# EAGLE design IDS_ADC_SMT_v2 (EAGLE 9.5.0)
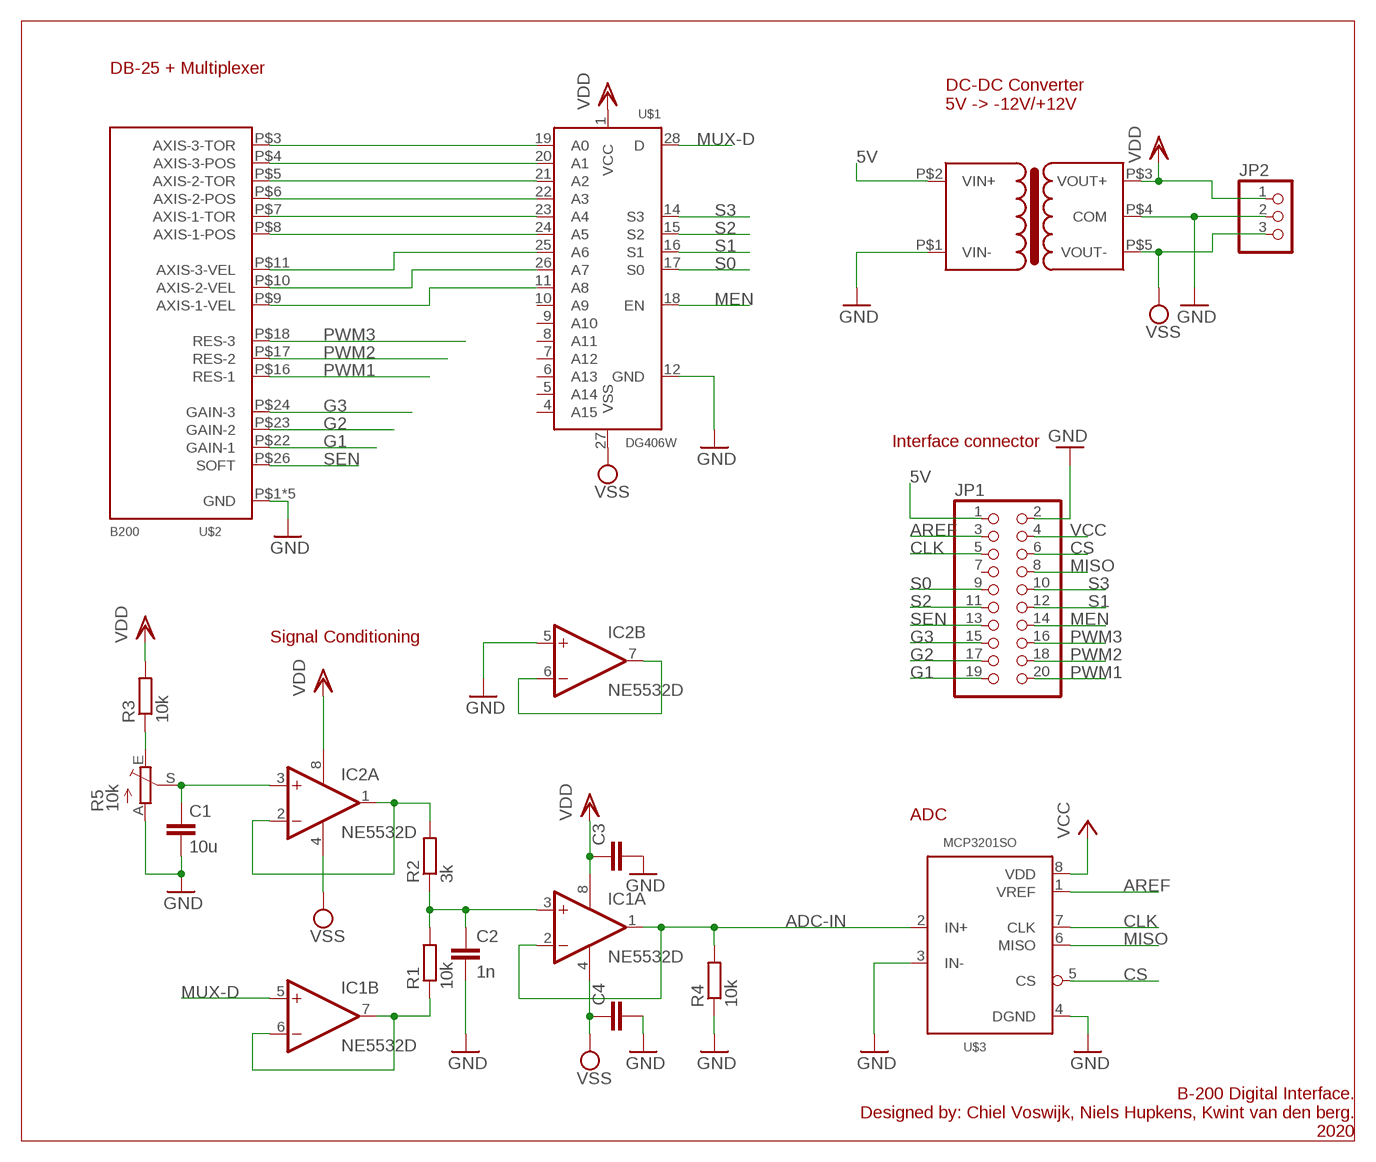
[diagram p0: schematic, sheet 1]

## Parts
C1  10u  C-EUC1210  [C1210]
C2  1n  C-EUC0805  [C0805]
C3  C-EUC0805  [C0805]
C4  C-EUC0805  [C0805]
IC1  NE5532D  [SO08]
IC2  NE5532D  [SO08]
JP1  PINHD-2X10  [2X10]
JP2  PINHD-1X3  [1X03]
R1  10k  R-EU_R0805  [R0805]
R2  3k  R-EU_R0805  [R0805]
R3  10k  R-EU_R0805  [R0805]
R4  10k  R-EU_R0805  [R0805]
R5  10k  TRIM_EU-RJ9W  [RJ9W]
U$1  DG406W  [SO-28W]
U$2  B200  [PARALLEL]
U$3  MCP3201SO  [SO-8]
U$4  TRACO-DR-NE  [TRACO-DCDC-SIP6]

## Nets
5V: JP1.1 U$4.P$2(VIN+)
ADC-IN: IC1.1(A:OUT) IC1.2(A:-IN) R4.2 U$3.2(IN+)
AREF: JP1.3 U$3.1(VREF)
CLK: JP1.5 U$3.7(CLK)
CS: JP1.6 U$3.5(CS)
G1: JP1.19 U$2.P$22(GAIN-1)
G2: JP1.17 U$2.P$23(GAIN-2)
G3: JP1.15 U$2.P$24(GAIN-3)
GND: C1.2 C2.2 C3.2 C4.2 IC2.5(B:+IN) JP1.2 JP2.2 R4.1 R5.A U$1.12(GND) U$2.P$1(GND) U$2.P$2(GND) U$2.P$19(GND) U$2.P$20(GND) U$2.P$21(GND) U$3.3(IN-) U$3.4(DGND) U$4.P$1(VIN-) U$4.P$4(COM)
MEN: JP1.14 U$1.18(EN)
MISO: JP1.8 U$3.6(MISO)
MUX-D: IC1.5(B:+IN) U$1.28(D)
N$1: IC2.6(B:-IN) IC2.7(B:OUT)
N$2: U$1.19(A0) U$2.P$3(AXIS-3-TOR)
N$3: C2.1 IC1.3(A:+IN) R1.2 R2.1
N$4: U$1.20(A1) U$2.P$4(AXIS-3-POS)
N$5: IC1.6(B:-IN) IC1.7(B:OUT) R1.1
N$6: U$1.21(A2) U$2.P$5(AXIS-2-TOR)
N$7: IC2.1(A:OUT) IC2.2(A:-IN) R2.2
N$8: C1.1 IC2.3(A:+IN) R5.S
N$9: U$1.22(A3) U$2.P$6(AXIS-2-POS)
N$10: U$1.23(A4) U$2.P$7(AXIS-1-TOR)
N$11: U$1.24(A5) U$2.P$8(AXIS-1-POS)
N$12: U$1.25(A6) U$2.P$11(AXIS-3-VEL)
N$13: U$1.26(A7) U$2.P$10(AXIS-2-VEL)
N$14: U$1.11(A8) U$2.P$9(AXIS-1-VEL)
N$15: R3.1 R5.E
PWM1: JP1.20 U$2.P$16(RES-1)
PWM2: JP1.18 U$2.P$17(RES-2)
PWM3: JP1.16 U$2.P$18(RES-3)
S0: JP1.9 U$1.17(S0)
S1: JP1.12 U$1.16(S1)
S2: JP1.11 U$1.15(S2)
S3: JP1.10 U$1.14(S3)
SEN: JP1.13 U$2.P$26(SOFT)
VCC: JP1.4 U$3.8(VDD)
VDD: C3.1 IC1.8(P:V+) IC2.8(P:V+) JP2.1 R3.2 U$1.1(VCC) U$4.P$3(VOUT+)
VSS: C4.1 IC1.4(P:V-) IC2.4(P:V-) JP2.3 U$1.27(VSS) U$4.P$5(VOUT-)
Unconnected: JP1.7 U$1.4(A15) U$1.5(A14) U$1.6(A13) U$1.7(A12) U$1.8(A11) U$1.9(A10) U$1.10(A9)

## Notes on the sheet
- DB-25 + Multiplexer
- DC-DC Converter
  5V -> -12V/+12V
- Interface connector
- Signal Conditioning
- ADC
- B-200 Digital Interface.
  Designed by: Chiel Voswijk, Niels Hupkens, Kwint van den berg.
  2020

## Library data of the parts
C1-C4 = rcl:C-EU: CAPACITOR, European symbol; SPICEPREFIX: C
IC1 IC2 = linear:NE5532: AUDIO AMPLIFIER
JP1 = pinhead:PINHD-2X10: PIN HEADER
JP2 = pinhead:PINHD-1X3: PIN HEADER
R1-R4 = rcl:R-EU_: RESISTOR, European symbol; SPICEPREFIX: R
R5 = pot:TRIM_EU-: POTENTIOMETER
U$1 = FHD-Actives:DG406: "Jellybean" DG406 Multiplexer
U$2 = FHD-Connectors:B200
U$3 = FHD-Actives:MCP3201
U$4 = FHD-POWER:TRACO-DR-NE

## Board
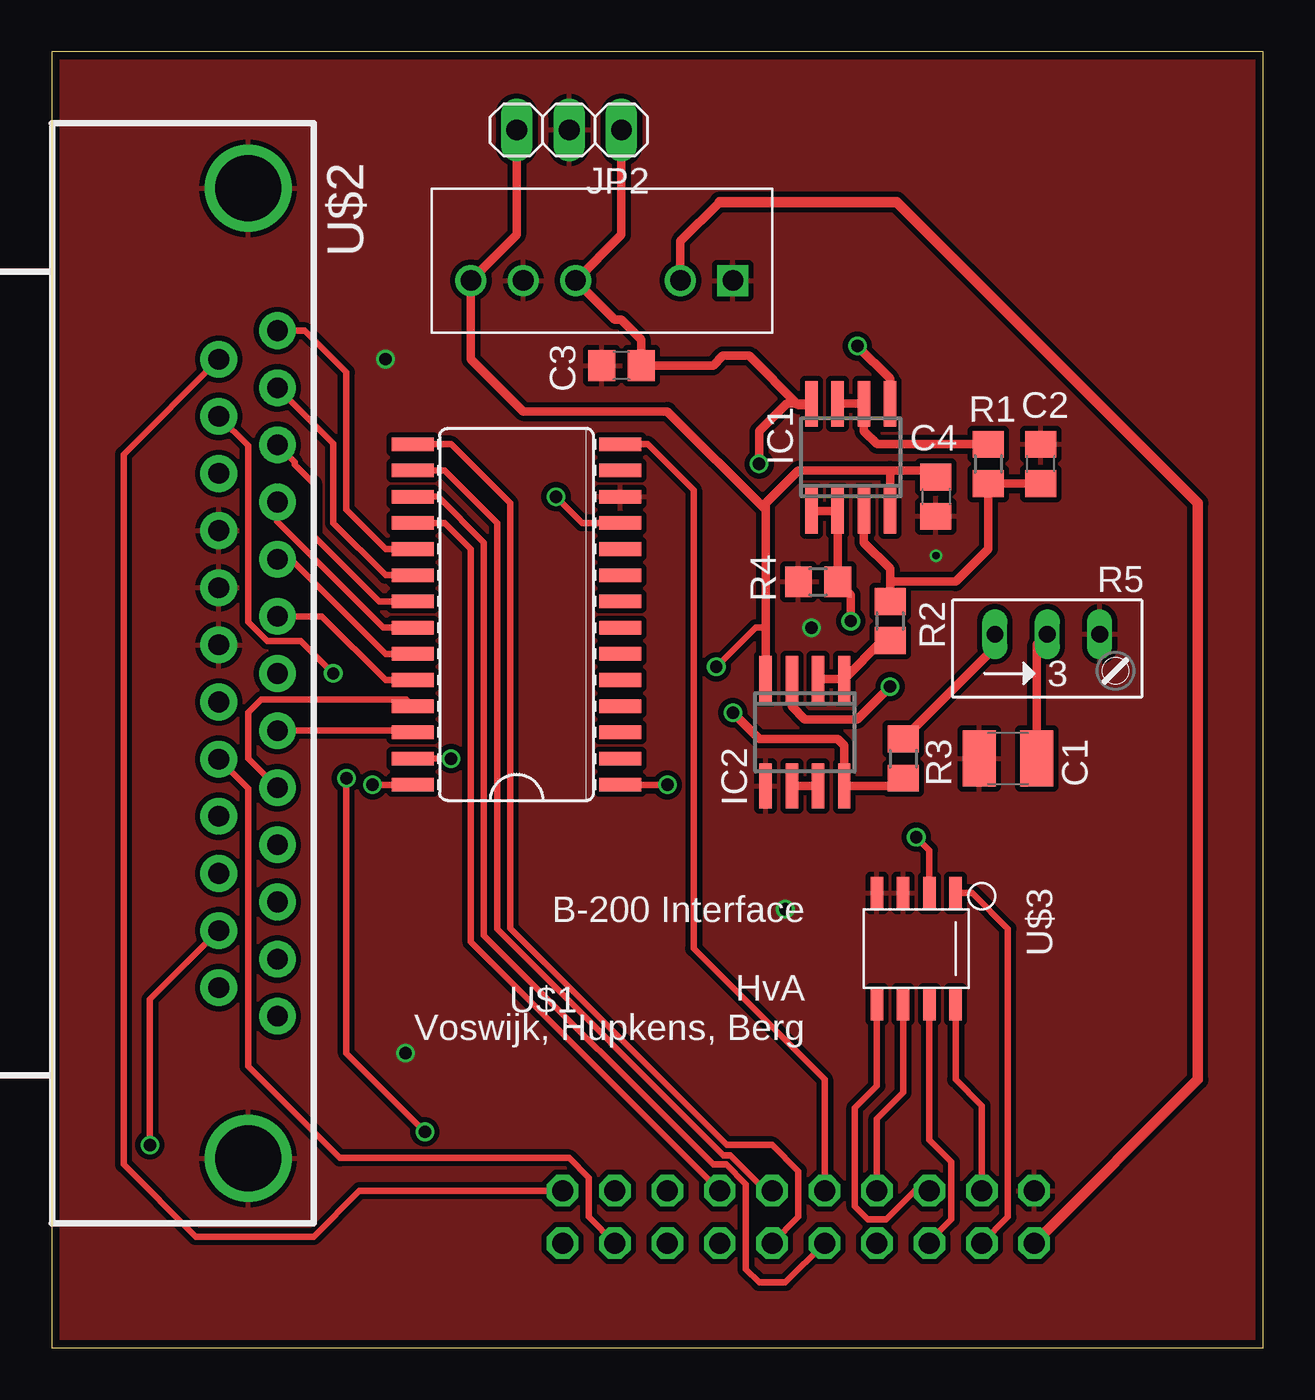
[diagram p1: board, top side]
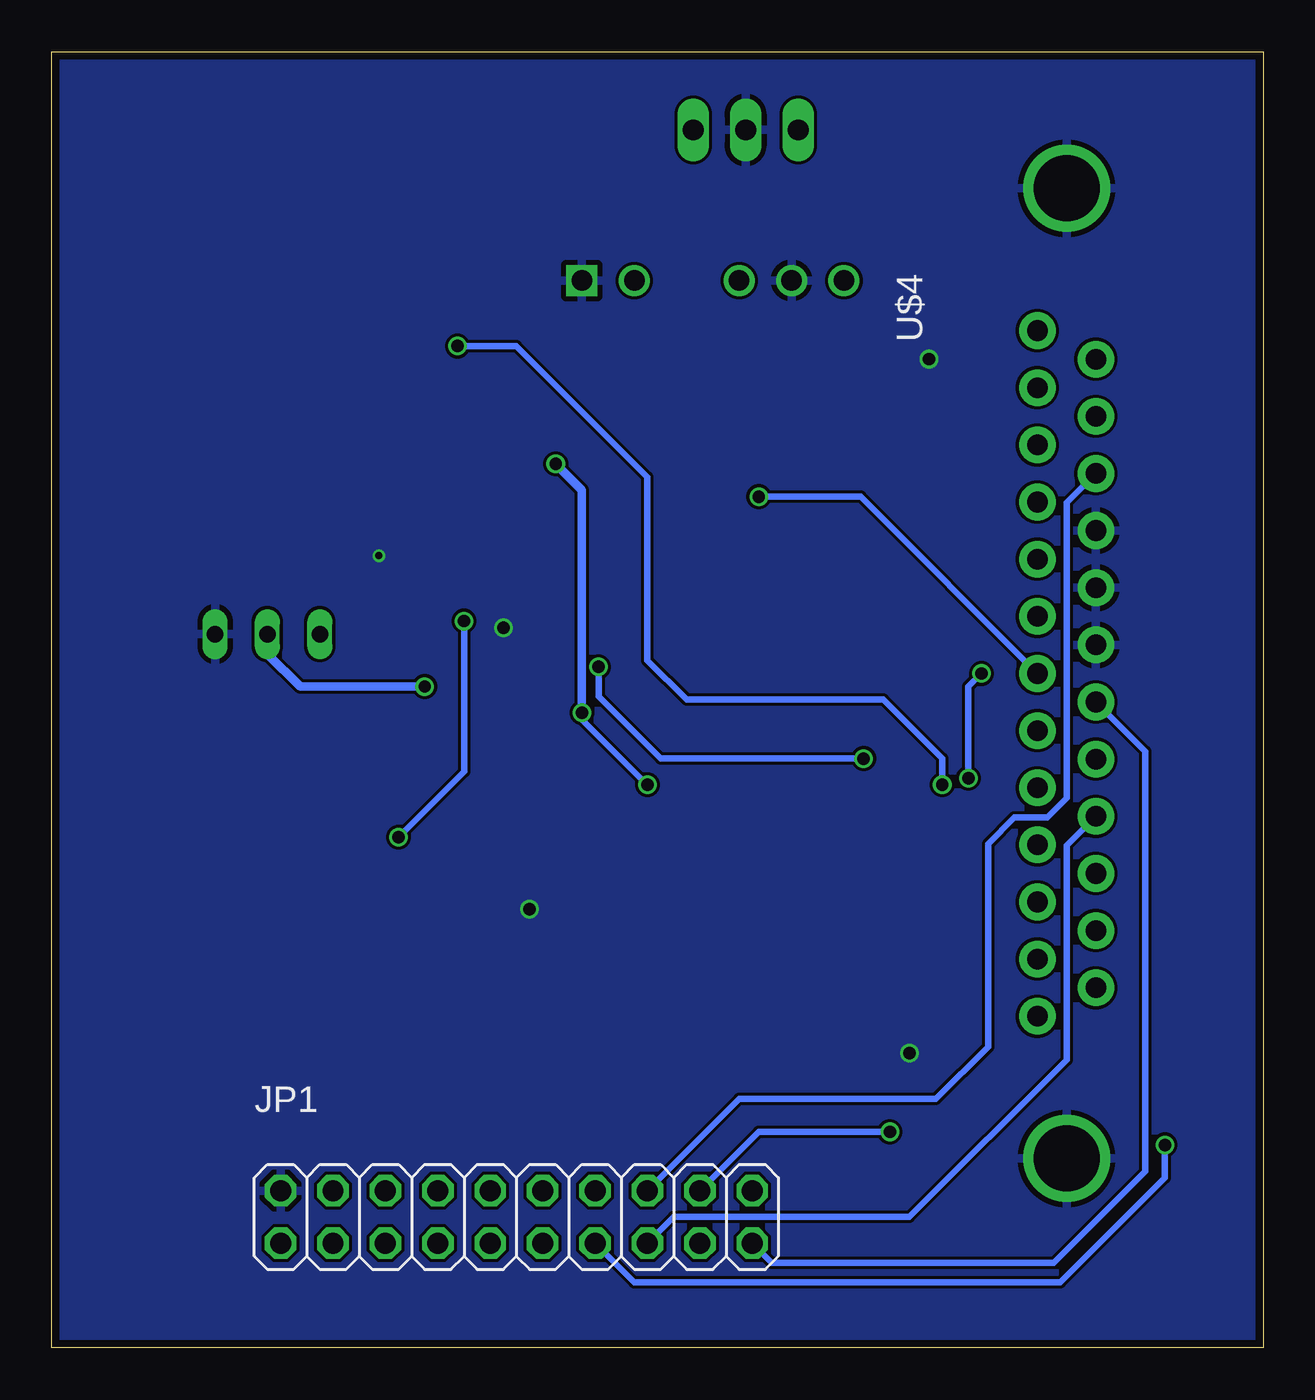
[diagram p2: board, bottom side, seen from below]

Size 58.72 x 62.85 mm. Coordinates in mm from the lower left corner, seen from the top.
Outline: 0,0 58.72,0 58.72,62.85 0,62.85 0,0
Copper layers (1*16): Top 0.035559375mm / dielectric 1.6mm / Bottom 0.035559375mm
Design rules "oshpark-2layer": minimum track width 6mil, minimum drill 10mil, track to track 6mil, track to pad 6mil, pad to pad 6mil, via to via 6mil, smd to smd 6mil, copper to edge 15mil, drill to drill 6mil, minimum pad ring 5mil, minimum via ring 5mil, stop-mask expansion 2.5mil, vias tented up to drill 0mil, thermal gap 10mil

### Footprints (pad centres in the part's own frame; a part is rotated, then mirrored left to right if it is on the bottom)
C1210 = smd 1.6 x 2.7: 1 -1.4,0; 2 1.4,0
C0805 = smd 1.3 x 1.5: 1 -0.95,0; 2 0.95,0
SO08 = smd 0.6 x 2.2: 1 -1.905,-2.6; 2 -0.635,-2.6; 3 0.635,-2.6; 4 1.905,-2.6; 5 1.905,2.6; 6 0.635,2.6; 7 -0.635,2.6; 8 -1.905,2.6
2X10 = drill 1.016 octagon: 1 -11.43,-1.27; 2 -11.43,1.27; 3 -8.89,-1.27; 4 -8.89,1.27; 5 -6.35,-1.27; 6 -6.35,1.27; 7 -3.81,-1.27; 8 -3.81,1.27; 9 -1.27,-1.27; 10 -1.27,1.27; 11 1.27,-1.27; 12 1.27,1.27; 13 3.81,-1.27; 14 3.81,1.27; 15 6.35,-1.27; 16 6.35,1.27; 17 8.89,-1.27; 18 8.89,1.27; 19 11.43,-1.27; 20 11.43,1.27
1X03 = drill 1.016 long: 1 -2.54,0; 2 0,0; 3 2.54,0
R0805 = smd 1.3 x 1.5: 1 -0.95,0; 2 0.95,0
RJ9W = drill 0.813 long: A 2.54,0.635; E -2.54,0.635; S 0,0.635
SO-28W = smd 0.66 x 2.032: 1 -8.255,-5.029; 2 -6.985,-5.029; 3 -5.715,-5.029; 4 -4.445,-5.029; 5 -3.175,-5.029; 6 -1.905,-5.029; 7 -0.635,-5.029; 8 0.635,-5.029; 9 1.905,-5.029; 10 3.175,-5.029; 11 4.445,-5.029; 12 5.715,-5.029; 13 6.985,-5.029; 14 8.255,-5.029; 15 8.255,5.029; 16 6.985,5.029; 17 5.715,5.029; 18 4.445,5.029; 19 3.175,5.029; 20 1.905,5.029; 21 0.635,5.029; 22 -0.635,5.029; 23 -1.905,5.029; 24 -3.175,5.029; 25 -4.445,5.029; 26 -5.715,5.029; 27 -6.985,5.029; 28 -8.255,5.029
PARALLEL = drill 3.2: P$1 -23.52,0; P$2 23.52,0 | drill 1 pad 1.778: P$3 -16.62,1.42; P$4 -13.85,1.42; P$5 -11.08,1.42; P$6 -8.31,1.42; P$7 -5.54,1.42; P$8 -2.77,1.42; P$9 0,1.42; P$10 2.77,1.42; P$11 5.54,1.42; P$12 8.31,1.42; P$13 11.08,1.42; P$14 13.85,1.42; P$15 16.62,1.42; P$16 -15.235,-1.42; P$17 -12.465,-1.42; P$18 -9.695,-1.42; P$19 -6.925,-1.42; P$20 -4.155,-1.42; P$21 -1.385,-1.42; P$22 1.385,-1.42; P$23 4.155,-1.42; P$24 6.925,-1.42; P$25 9.695,-1.42; P$26 12.465,-1.42; P$27 15.235,-1.42
SO-8 = smd 0.6 x 1.55: 1 -1.905,-2.69; 2 -0.635,-2.69; 3 0.635,-2.69; 4 1.905,-2.69; 5 1.905,2.71; 6 0.635,2.71; 7 -0.635,2.71; 8 -1.905,2.71
TRACO-DCDC-SIP6 = drill 1 square: P$1 -8.89,1.27 | drill 1: P$2 -6.35,1.27; P$3 -1.27,1.27; P$4 1.27,1.27; P$5 3.81,1.27

### Placement (x,y rotation side)
C1  46.35,28.57 180 top
C2  47.94,42.86 90 top
C3  27.62,47.62 180 top
C4  42.86,41.27 270 top
IC1  38.73,43.18 0 top
IC2  36.51,29.84 180 top
JP1  36.2,6.35 0 bottom
JP2  25.08,59.05 180 top
R1  45.4,42.86 270 top
R2  40.64,35.24 270 top
R3  41.27,28.57 270 top
R4  37.15,37.15 0 top
R5  48.26,33.97 0 top
U$1  22.54,35.56 90 top
U$2  9.53,32.7 270 top
U$3  41.91,19.37 180 top
U$4  24.13,53.02 180 top

### Tracks (layer width: path | path; a pad name or v marks a point on that pad's centre or on a via)
5V
  Top 0.406: 32.38,55.56 30.48,53.66 U$4.P$2
  Top 0.508: JP1.1 55.56,13.02 55.56,40.96 40.96,55.56 32.38,55.56
ADC-IN  (via drill 0.6)
  Top 0.305: U$3.2 42.54,24.13 v41.91,24.76
  Top 0.406: IC1.1 IC1.2 R4.2 38.73,36.51 v38.73,35.24
  Bottom 0.305: v41.91,24.76 38.73,27.94 v38.73,35.24
AREF
  Top 0.305: JP1.3 46.35,6.35 46.35,20.32 44.62,22.06 U$3.1
CLK
  Top 0.305: U$3.7 42.54,10.08 43.61,9.01 43.61,6.23 42.54,5.16 JP1.5
CS
  Top 0.305: U$3.5 40,12.71 38.94,11.64 38.94,6.86 39.56,6.24 40.45,6.24 41.83,7.62 JP1.6
G1
  Bottom 0.305: U$2.P$22 5.71,28.93 5.71,8.57 10.16,4.13 23.81,4.13 JP1.19
G2
  Top 0.305: JP1.17 26.04,6.35 26.04,8.26 25.08,9.21 13.97,9.21 9.53,13.65 9.53,27.13 U$2.P$23
G3
  Bottom 0.305: U$2.P$24 9.53,24.36 9.53,13.97 17.14,6.35 28.57,6.35 JP1.15
GND  (via drill 0.35, 0.6)
  other vias: 17.14,14.29 16.19,47.94 36.83,34.92 42.86,38.42 35.56,21.27
  pour Top (isolate 0.254): -3.49,0 58.74,0 58.74,65.72 -3.49,65.72
  pour Bottom: -1.27,-1.27 66.04,-1.27 66.04,64.77 -1.27,64.77
MEN
  Top 0.305: JP1.14 20.32,19.69 20.32,38.74 19.05,40 U$1.18
MISO
  Top 0.305: JP1.8 40,11.11 41.27,12.38 U$3.6
MUX-D  (via drill 0.6)
  Top 0.305: U$1.28 v15.56,27.31
  Top 0.406: v39.05,48.58 40.64,46.99 IC1.5
  Bottom 0.305: v15.56,27.31 15.56,28.58 18.42,31.43 27.94,31.43 29.85,33.34 29.85,42.23 36.2,48.58 v39.05,48.58
N$1
  Top 0.406: IC2.7 IC2.6
N$2
  Top 0.305: U$1.19 16.19,38.74 14.29,40.64 14.29,47.31 12.27,49.32 U$2.P$3
N$3
  Top 0.406: C2.1 R1.2 45.4,38.74 43.81,37.15 40.64,37.15 | IC1.3 39.37,39.05 40.64,37.78 40.64,37.15 | 40.64,37.15 R2.1
N$4
  Top 0.305: U$2.P$4 13.65,43.85 13.65,40 16.19,37.46 U$1.20
N$5
  Top 0.406: IC1.7 IC1.6 39.37,44.45 40.01,43.81 R1.1
N$6
  Top 0.305: U$2.P$5 11.78,42.95 11.78,42.83 12.7,41.91 12.7,39.37 15.87,36.2 U$1.21
N$7
  Top 0.406: IC2.2 IC2.1 40.27,34.29 R2.2
N$8  (via drill 0.6)
  Top 0.406: IC2.3 35.88,31.11 36.51,30.48 39.05,30.48 v40.64,32.07 | C1.1 47.75,34.1 R5.S
  Bottom 0.406: v40.64,32.07 46.67,32.07 48.26,33.66 R5.S
N$9
  Top 0.305: U$2.P$6 10.95,40.06 16.08,34.92 U$1.22
N$10
  Top 0.305: U$2.P$7 11.09,38.1 11.75,38.1 16.19,33.66 U$1.23
N$11
  Top 0.305: U$2.P$8 13.1,35.47 16.19,32.38 U$1.24
N$12
  Top 0.305: U$2.P$11 9.53,28.58 9.53,30.8 10.16,31.43 17.2,31.43 U$1.25
N$13
  Top 0.305: U$1.26 17.43,29.93 U$2.P$10
N$14  (via drill 0.6)
  Top 0.305: U$1.11 25.72,40 v24.45,41.28
  Bottom 0.305: U$2.P$9 19.52,41.28 v24.45,41.28
N$15
  Top 0.406: R3.1 45.72,33.97 R5.E
PWM1
  Top 0.305: U$2.P$16 3.49,43.32 3.49,8.89 6.98,5.4 12.7,5.4 14.92,7.62 JP1.20
PWM2  (via drill 0.6)
  Top 0.305: v18.1,10.48 14.29,14.29 v14.29,27.62 | v13.65,32.7 12.08,34.28 10.45,34.28 9.53,35.2 9.53,43.75 U$2.P$17
  Bottom 0.305: JP1.18 24.45,10.48 v18.1,10.48 | v14.29,27.62 14.29,32.07 v13.65,32.7
PWM3
  Bottom 0.305: U$2.P$18 9.53,40.98 9.53,26.67 10.48,25.72 12.06,25.72 13.33,24.45 13.33,14.61 15.87,12.06 25.4,12.06 JP1.16
S0
  Top 0.305: U$1.17 18.73,41.28 20.96,39.05 20.96,20 32.07,8.89 32.7,8.89 33.66,7.94 33.66,3.81 34.29,3.17 35.56,3.17 JP1.9
S1
  Top 0.305: U$1.16 19.05,42.55 21.59,40 21.59,20.32 32.56,9.35 32.89,9.35 34.62,7.62 JP1.12
S2
  Top 0.305: JP1.11 36.2,6.35 36.2,8.57 34.92,9.84 32.71,9.84 22.23,20.33 22.23,40.96 19.37,43.81 U$1.15
S3
  Top 0.305: U$1.14 28.89,43.81 31.11,41.59 31.11,19.37 37.46,13.02 JP1.10
SEN  (via drill 0.6)
  Top 0.305: U$2.P$26 4.76,16.89 v4.76,9.84
  Bottom 0.305: v4.76,9.84 4.76,8.26 9.84,3.17 30.48,3.17 JP1.13
VCC
  Top 0.305: U$3.8 43.81,13.02 45.09,11.75 JP1.4
VDD  (via drill 0.6)
  Top 0.305: U$1.1 v29.85,27.31
  Top 0.406: v33.02,30.8 34.29,29.53 38.1,29.53 38.42,29.21 IC2.8 40.89,27.24 R3.2 | v34.29,42.86 34.29,44.45 35.62,45.78 IC1.8 36.77,45.72 36.2,45.72 33.81,48.1 32.54,48.1 32.06,47.63 C3.1 28.57,48.9 27.62,49.85 27.3,49.85 U$4.P$3 27.62,53.98 JP2.1
  Bottom 0.305: v29.85,27.31 33.02,30.48 v33.02,30.8
  Bottom 0.406: v33.02,30.8 33.02,41.59 v34.29,42.86
VSS  (via drill 0.6)
  Top 0.305: U$1.27 v19.37,28.58 | v32.21,33.02 34.12,34.92 34.61,34.92
  Top 0.406: IC2.4 34.61,34.92 34.61,40.64 | 34.61,40.64 34.61,40.96 36.2,42.55 40.64,42.55 | 40.64,42.55 42.54,42.55 C4.1 | IC1.4 40.64,42.55 | 34.61,40.64 29.85,45.4 22.86,45.4 20.32,47.94 U$4.P$5 22.54,53.98 JP2.3
  Bottom 0.305: v19.37,28.58 29.21,28.58 32.21,31.58 v32.21,33.02

### Text on the board
tNames: B-200 Interface / / HvA / Voswijk, Hupkens, Berg